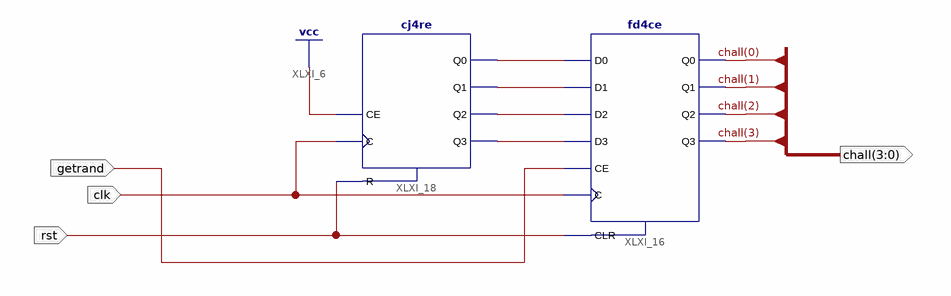
[diagram p0: schematic sheet 1]
// Xilinx ISE schematic rand.sch (xc9500xl) as structural Verilog: 2 symbols, 4 ports
module \rand  (
  input  rst,
  input  clk,
  input  getrand,
  output [3:0] chall
);

  wire XLXN_66, XLXN_67, XLXN_68, XLXN_69;

  cj4re XLXI_18 (.C(clk), .CE(1'b1), .R(rst), .Q0(XLXN_66), .Q1(XLXN_67), .Q2(XLXN_68), .Q3(XLXN_69));
  fd4ce XLXI_16 (
    .C(clk), .CE(getrand), .CLR(rst), .D0(XLXN_66), .D1(XLXN_67), .D2(XLXN_68), .D3(XLXN_69), .Q0(chall[0]),
    .Q1(chall[1]), .Q2(chall[2]), .Q3(chall[3]));
endmodule
